# EAGLE schematic shield (EAGLE 6.5.0)
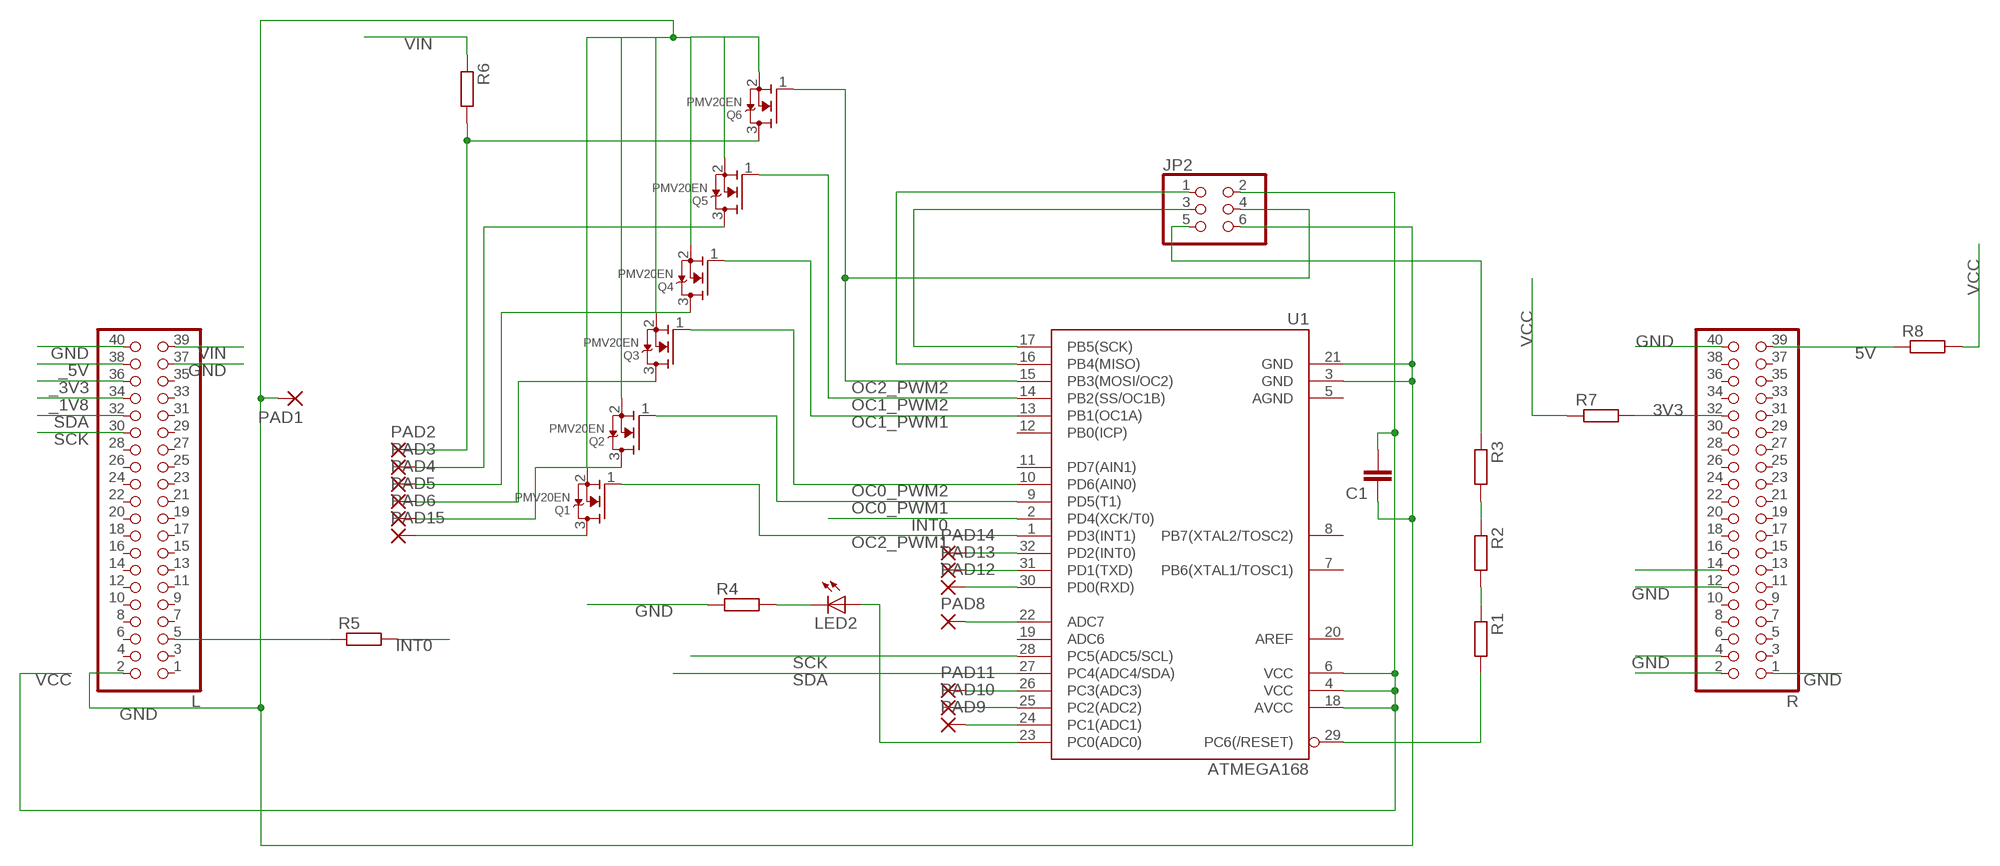
[diagram p0: schematic, sheet 1]

## Parts
C1  C-EUC0805  [C0805]
JP2  PINHD-2X3  [2X03]
L  PINHD-2X20  [2X20]
LED2  LEDCHIP-LED0805  [CHIP-LED0805]
PAD1  2,54/0,9  [2,54/0,9]
PAD2  2,54/0,9  [2,54/0,9]
PAD3  2,54/0,9  [2,54/0,9]
PAD4  2,54/0,9  [2,54/0,9]
PAD5  2,54/0,9  [2,54/0,9]
PAD6  2,54/0,9  [2,54/0,9]
PAD8  2,54/0,9  [2,54/0,9]
PAD9  2,54/0,9  [2,54/0,9]
PAD10  2,54/0,9  [2,54/0,9]
PAD11  2,54/0,9  [2,54/0,9]
PAD12  2,54/0,9  [2,54/0,9]
PAD13  2,54/0,9  [2,54/0,9]
PAD14  2,54/0,9  [2,54/0,9]
PAD15  2,54/0,9  [2,54/0,9]
Q1  PMV20EN  MOSFET-NREFLOW  [SOT23]
Q2  PMV20EN  MOSFET-NREFLOW  [SOT23]
Q3  PMV20EN  MOSFET-NREFLOW  [SOT23]
Q4  PMV20EN  MOSFET-NREFLOW  [SOT23]
Q5  PMV20EN  MOSFET-NREFLOW  [SOT23]
Q6  PMV20EN  MOSFET-NREFLOW  [SOT23]
R  PINHD-2X20  [2X20]
R1  R-EU_M1206  [M1206]
R2  R-EU_M1206  [M1206]
R3  R-EU_M1206  [M1206]
R4  R-EU_M1206  [M1206]
R5  R-EU_M1206  [M1206]
R6  R-EU_M1206  [M1206]
R7  R-EU_M0805  [M0805]
R8  R-EU_M0805  [M0805]
U1  ATMEGA168  [TQFP32-08]

## Nets
3V3: R7.2 R.32
5V: R8.1 R.39
_1V8: L.34
_3V3: L.36
_5V: L.38
GND: C1.1 JP2.6 L.2 L.37 L.40 PAD1.1(P) Q1.2(S) Q2.2(S) Q3.2(S) Q4.2(S) Q5.2(S) Q6.2(S) R4.1 R.1 R.4 R.12 R.40 U1.3(GND) U1.21(GND)
INT0: R5.2 U1.2(PD4(XCK/T0))
N$1: R1.2 U1.29(PC6(/RESET))
N$2: JP2.1 U1.16(PB4(MISO))
N$3: JP2.3 U1.17(PB5(SCK))
N$4: PAD15.1(P) Q1.3(D)
N$5: PAD6.1(P) Q2.3(D)
N$6: PAD5.1(P) Q3.3(D)
N$7: PAD4.1(P) Q4.3(D)
N$8: PAD3.1(P) Q5.3(D)
N$9: PAD2.1(P) Q6.3(D) R6.2
N$10: JP2.5 R3.1
N$11: PAD12.1(P) U1.30(PD0(RXD))
N$12: PAD13.1(P) U1.31(PD1(TXD))
N$13: PAD14.1(P) U1.32(PD2(INT0))
N$14: PAD8.1(P) U1.22(ADC7)
N$15: PAD9.1(P) U1.24(PC1(ADC1))
N$16: PAD10.1(P) U1.25(PC2(ADC2))
N$17: PAD11.1(P) U1.26(PC3(ADC3))
N$18: R1.1 R2.2
N$19: R.14
N$21: R2.1 R3.2
N$23: LED2.C R4.2
N$24: R.2
N$25: L.5 R5.1
N$26: LED2.A U1.23(PC0(ADC0))
OC0_PWM1: Q2.1(G) U1.9(PD5(T1))
OC0_PWM2: Q3.1(G) U1.10(PD6(AIN0))
OC1_PWM1: Q4.1(G) U1.13(PB1(OC1A))
OC1_PWM2: Q5.1(G) U1.14(PB2(SS/OC1B))
OC2_PWM1: Q1.1(G) U1.1(PD3(INT1))
OC2_PWM2: JP2.4 Q6.1(G) U1.15(PB3(MOSI/OC2))
SCK: L.30 U1.28(PC5(ADC5/SCL))
SDA: L.32 U1.27(PC4(ADC4/SDA))
VCC: C1.2 JP2.2 R7.1 R8.2 U1.4(VCC) U1.6(VCC) U1.18(AVCC)
VIN: L.39 R6.1
Unconnected: L.1 L.3 L.4 L.6 L.7 L.8 L.9 L.10 L.11 L.12 L.13 L.14 L.15 L.16 L.17 L.18 L.19 L.20 L.21 L.22 L.23 L.24 L.25 L.26 L.27 L.28 L.29 L.31 L.33 L.35 R.3 R.5 R.6 R.7 R.8 R.9 R.10 R.11 R.13 R.15 R.16 R.17 R.18 R.19 R.20 R.21 R.22 R.23 R.24 R.25 R.26 R.27 R.28 R.29 R.30 R.31 R.33 R.34 R.35 R.36 R.37 R.38 U1.5(AGND) U1.7(PB6(XTAL1/TOSC1)) U1.8(PB7(XTAL2/TOSC2)) U1.11(PD7(AIN1)) U1.12(PB0(ICP)) U1.19(ADC6) U1.20(AREF)

## Library data of the parts
C1 = rcl:C-EU: CAPACITOR, European symbol
JP2 = pinhead:PINHD-2X3: PIN HEADER
L R = pinhead:PINHD-2X20: PIN HEADER
LED2 = led:LED: LED OSRAM: - CHIPLED LG R971, LG N971, LY N971, LG Q971, LY Q971, LO R971, LY R971 LH N974, LH R974 LS Q976, LO Q976, LY Q976 LO Q996 - Hyper CHIPLED LW Q18S LB Q993, LB Q99A, LB R99A - SideLED LS A670, LO A670, LY A670, LG A670, LP A670 LB A673, LV A673, LT A673, LW A673 LH A674 LY A675 LS A676, LA A676, LO A676, LY A676, LW A676 LS A679, LY A679, LG A679 - Hyper Micro SIDELED® LS Y876, LA Y876, LO Y876, LY Y876 LT Y87S - SmartLED LW L88C, LW L88S LB L89C, LB L89S, LG L890 LS L89K, LO L89K, LY L89K LS L896, LA L896, LO L896, LY L896 - TOPLED LS T670, LO T670, LY T670, LG T670, LP T670 LSG T670, LSP T670, LSY T670, LOP T670, LYG T670 LG T671, LOG T671, LSG T671 LB T673, LV T673, LT T673, LW T673 LH T674 LS T676, LA T676, LO T676, LY T676, LB T676, LH T676, LSB T676, LW T676 LB T67C, LV T67C, LT T67C, LS T67K, LO T67K, LY T67K, LW E67C LS E67B, LA E67B, LO E67B, LY E67B, LB E67C, LV E67C, LT E67C LW T67C LS T679, LY T679, LG T679 LS T770, LO T770, LY T770, LG T770, LP T770 LB T773, LV T773, LT T773, LW T773 LH T774 LS E675, LA E675, LY E675, LS T675 LS T776, LA T776, LO T776, LY T776, LB T776 LHGB T686 LT T68C, LB T68C - Hyper Mini TOPLED® LB M676 - Mini TOPLED Santana® LG M470 LS M47K, LO M47K, LY M47K Source: http://www.osram.convergy.de LUXEON: - LUMILED® LXK2-PW12-R00, LXK2-PW12-S00, LXK2-PW14-U00, LXK2-PW14-V00 LXK2-PM12-R00, LXK2-PM12-S00, LXK2-PM14-U00 LXK2-PE12-Q00, LXK2-PE12-R00, LXK2-PE12-S00, LXK2-PE14-T00, LXK2-PE14-U00 LXK2-PB12-K00, LXK2-PB12-L00, LXK2-PB12-M00, LXK2-PB14-N00, LXK2-PB14-P00, LXK2-PB14-Q00 LXK2-PR12-L00, LXK2-PR12-M00, LXK2-PR14-Q00, LXK2-PR14-R00 LXK2-PD12-Q00, LXK2-PD12-R00, LXK2-PD12-S00 LXK2-PH12-R00, LXK2-PH12-S00 LXK2-PL12-P00, LXK2-PL12-Q00, LXK2-PL12-R00 Source: www.luxeon.com KINGBRIGHT: KA-3528ASYC Source: www.kingbright.com
PAD1-PAD6 PAD8-PAD15 = wirepad:2,54/0,9: THROUGH-HOLE PAD
Q1-Q6 = adafruit:MOSFET-N: N-Channel Mosfet 2N7002E - 60V 260mA SOT23 [Digikey: 2N7002ET1GOSTR-ND] - REEL BSH103 - 30V 850mA SOT23 [Digikey: 568-5013-1-ND]
R1-R8 = rcl:R-EU_: RESISTOR, European symbol
U1 = SparkFun-DigitalIC:ATMEGA168: Atmel 32-pin 8-bit micro, 16k flash.